# Altium schematic sheet IsolatedPower.SchDoc
size Letter; SheetNumber: 3; SheetTotal: 4
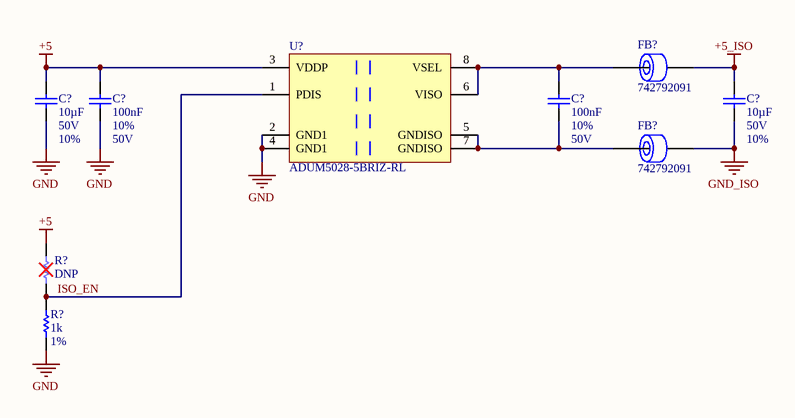
[diagram p0: IsolatedPower.SchDoc]

## Parts
(Parts that share a designator on the sheet are numbered #1, #2 ... from top to bottom, then left to right.)
C?#1  value 10µF  Voltage: 50V  Tolerance: 10%  [1206_CAP]  (hidden comment: CAP 1206 10UF 50V 10% X5R)
C?#2  value 10µF  Voltage: 50V  Tolerance: 10%  [1206_CAP]  (hidden comment: CAP 1206 10UF 50V 10% X5R)
C?#3  value 100nF  Tolerance: 10%  Voltage: 50V  [0805_CAP]  (hidden comment: CAP 0805 0.1UF 50V 10% X7R)
C?#4  value 100nF  Tolerance: 10%  Voltage: 50V  [0805_CAP]  (hidden comment: CAP 0805 0.1UF 50V 10% X7R)
FB?#1  742792091  [0805]
FB?#2  742792091  [0805]
R?#1  value DNP  [0805_RES]  (hidden comment: RES 0805 DNP)  (no BOM)
R?#2  value 1k  Tolerance: 1%  [0805_RES]  (hidden comment: RES 0805 1K 1%)
U?  ADUM5028-5BRIZ-RL  [FP-RI-8-1-IPC_B]

## Nets
+5: C?#1.1 C?#3.2 R?#1.2 U?.3(VDDP)
+5_ISO: C?#2.1 FB?#1.2
GND: C?#1.2 C?#3.1 R?#2.1 U?.2(GND1) U?.4(GND1)
GND_ISO: C?#2.2 FB?#2.2
ISO_EN: R?#1.1 R?#2.2 U?.1(PDIS)
NetC?#4_1: C?#4.1 FB?#2.1 U?.5(GNDISO) U?.7(GNDISO)
NetC?#4_2: C?#4.2 FB?#1.1 U?.6(VISO) U?.8(VSEL)

## Notes on the sheet
- Title:
- Desc:
- Size:
- Letter
- Auth:
- Sheet
- of
- www.seas.upenn.edu
- Electrical and Systems Engineering
- Proj:

## Library data of the parts
C?#1 C?#2 = CMP-001-00003-6: Capacitor Surface Mount 1206 Footprint 10UF 25V 10% Tolerance Ceramic X5R; Manufacturer: Various; PCB Package: 1206; Description in Visual: Cap SMT 1206 10UF 50V 10%  Cer X5R; Case/Package: 1206; RoHS: Yes; JLCPCB Part #: C13585; Manufacturer P/N: CAP 1206 10UF 50V 10% X5R; P/N: CAP 1206 10UF 50V 10% X5R; Type: Ceramic X5R; Capacitor Type: Ceramic; Mount: SMT
C?#3 C?#4 = CMP-011-000431-5: Capacitor Surface Mount 0805 Footprint 0.1UF 50V 10% Tolerance Ceramic X7R; Manufacturer: Various; Description in Visual: Cap SMT 0805 0.1UF 50V 10%  Cer X7R; PCB Package: 0805; Capacitor Type: Ceramic; Type: Ceramic X7R; RoHS: Yes; Case/Package: 0805; Pins: 2; P/N: CAP 0805 0.1UF 50V 10% X7R; Mount: SMT; Manufacturer P/N: CAP 0805 0.1UF 50V 10% X7R
FB?#1 FB?#2 = CMP-00332-4: Ferrite Chip 200 mA 1500 Ohms Differential Mode - Single 0805 Footprint; Manufacturer: Wurth Electronics; Current (mA): 200; Frequency: 100MHz; Description in Visual: Ferrite SMT 200mA 1500Ohm Dif Mode 0805; DC Resistance (ohms): 0.55; Usage: Wide Band; Impedance at Freq (ohms): 1.5kHz; Operating Temperature Range: -55 to +125 °C; ComponentLink3URL: http://octopart.com/partsearch/#search/requestData&q=742792091; ComponentLink1URL: http://www.we-online.com; ComponentLink2Description: Component Datasheet; ComponentLink1Description: Manufacturer Website; P/N: 742792091; ComponentLink3Description: Octopart Link; ComponentLink2URL: http://www.we-online.com/eisos/pdf/742792091.pdf; Filter type: Differential Mode - Single; Manufacturer P/N: 742792091; PCB Package: 0805
R?#1 = CMP-005-005748-3: Resistor Do Not Populate 0805 Footprint 0.125W; Manufacturer: Various; PCB Package: 0805; Manufacturer P/N: RES 0805 DNP; Power Rating: 0.125W; Mount: SMT
R?#2 = CMP-005-004398-3: Resistor Surface Mount, 1K Ohms, 0805 Footprint, 1% Tolerance 0.125W; Manufacturer: Various; Description in Visual: Res SMT 1K 0805  1%  0.125W; PCB Package: 0805; Mount: SMT; Manufacturer P/N: RES 0805 1K 1%; JLCPCB Part #: C17513; Power Rating: 0.125W
U? = CMP-00802-1: Dc To Dc Converter, Fixed, Buck, Soic-8 Rohs Compliant: Yes; Manufacturer Lifecycle Status: PRODUCTION; Min Supply Voltage: 4.5V; Number of Outputs: 1; Output Voltage: 5V; Max Supply Voltage: 5.5V; Lifecycle Status: Production; Height: 2.65mm; RoHS: Compliant; Max Operating Temperature: 125°C; Schedule B: 8542390000, 8543709655, 8543709655; Ambient Temperature Range High: 125°C; Min Operating Temperature: -40°C; Pins: 8